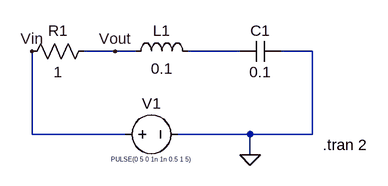
[diagram p0: schematic RLC_Circuit.asc]
RLC_Circuit.asc, the LTspice schematic file:
Version 4.1
SHEET 1 880 680
WIRE 128 96 80 96
WIRE 160 96 128 96
WIRE 320 96 240 96
WIRE 432 96 384 96
WIRE 0 224 0 96
WIRE 144 224 0 224
WIRE 336 224 224 224
WIRE 432 224 432 96
WIRE 432 224 336 224
WIRE 336 256 336 224
FLAG 336 256 0
FLAG 0 96 Vin
FLAG 128 96 Vout
SYMBOL res 96 80 R90
WINDOW 0 0 56 VBottom 2
WINDOW 3 32 56 VTop 2
SYMATTR InstName R1
SYMATTR Value 1
SYMBOL ind 144 112 R270
WINDOW 0 32 56 VTop 2
WINDOW 3 5 56 VBottom 2
SYMATTR InstName L1
SYMATTR Value 0.1
SYMBOL cap 384 80 R90
WINDOW 0 0 32 VBottom 2
WINDOW 3 32 32 VTop 2
SYMATTR InstName C1
SYMATTR Value 0.1
SYMBOL voltage 128 224 R270
WINDOW 0 32 56 VTop 2
WINDOW 3 -32 56 VBottom 0
WINDOW 123 0 0 Left 0
WINDOW 39 0 0 Left 0
SYMATTR InstName V1
SYMATTR Value PULSE(0 5 0 1n 1n 0.5 1 5)
TEXT 448 240 Left 2 !.tran 2

The netlist it stands for:
* RLC_Circuit.asc
R1 Vout Vin 1
L1 Vout N001 0.1
C1 0 N001 0.1
V1 Vin 0 PULSE(0 5 0 1n 1n 0.5 1 5)
.tran 2
.backanno
.end